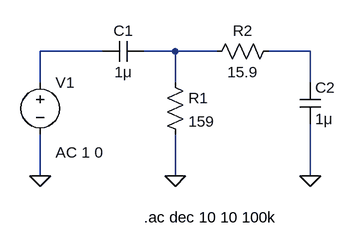
[diagram p0: schematic band_pass_filter.asc]
band_pass_filter.asc, the LTspice schematic file:
Version 4.1
SHEET 1 880 680
WIRE 208 48 112 48
WIRE 320 48 272 48
WIRE 384 48 320 48
WIRE 528 48 464 48
WIRE 112 96 112 48
WIRE 320 96 320 48
WIRE 528 96 528 48
WIRE 112 240 112 176
WIRE 320 240 320 176
WIRE 528 240 528 160
FLAG 112 240 0
FLAG 320 240 0
FLAG 528 240 0
SYMBOL voltage 112 80 R0
WINDOW 123 24 124 Left 2
WINDOW 39 0 0 Left 0
SYMATTR Value2 AC 1 0
SYMATTR InstName V1
SYMATTR Value ""
SYMBOL cap 272 32 R90
WINDOW 0 0 32 VBottom 2
WINDOW 3 32 32 VTop 2
SYMATTR InstName C1
SYMATTR Value 1μ
SYMBOL res 304 80 R0
SYMATTR InstName R1
SYMATTR Value 159
SYMBOL res 480 32 R90
WINDOW 0 0 56 VBottom 2
WINDOW 3 32 56 VTop 2
SYMATTR InstName R2
SYMATTR Value 15.9
SYMBOL cap 512 96 R0
SYMATTR InstName C2
SYMATTR Value 1μ
TEXT 272 304 Left 2 !.ac dec 10 10 100k

The netlist it stands for:
* band_pass_filter.asc
V1 N001 0 AC 1 0
C1 N002 N001 1μ
R1 N002 0 159
R2 N003 N002 15.9
C2 N003 0 1μ
.ac dec 10 10 100k
.backanno
.end